# EAGLE design Inverter V2 (EAGLE 9.6.2)
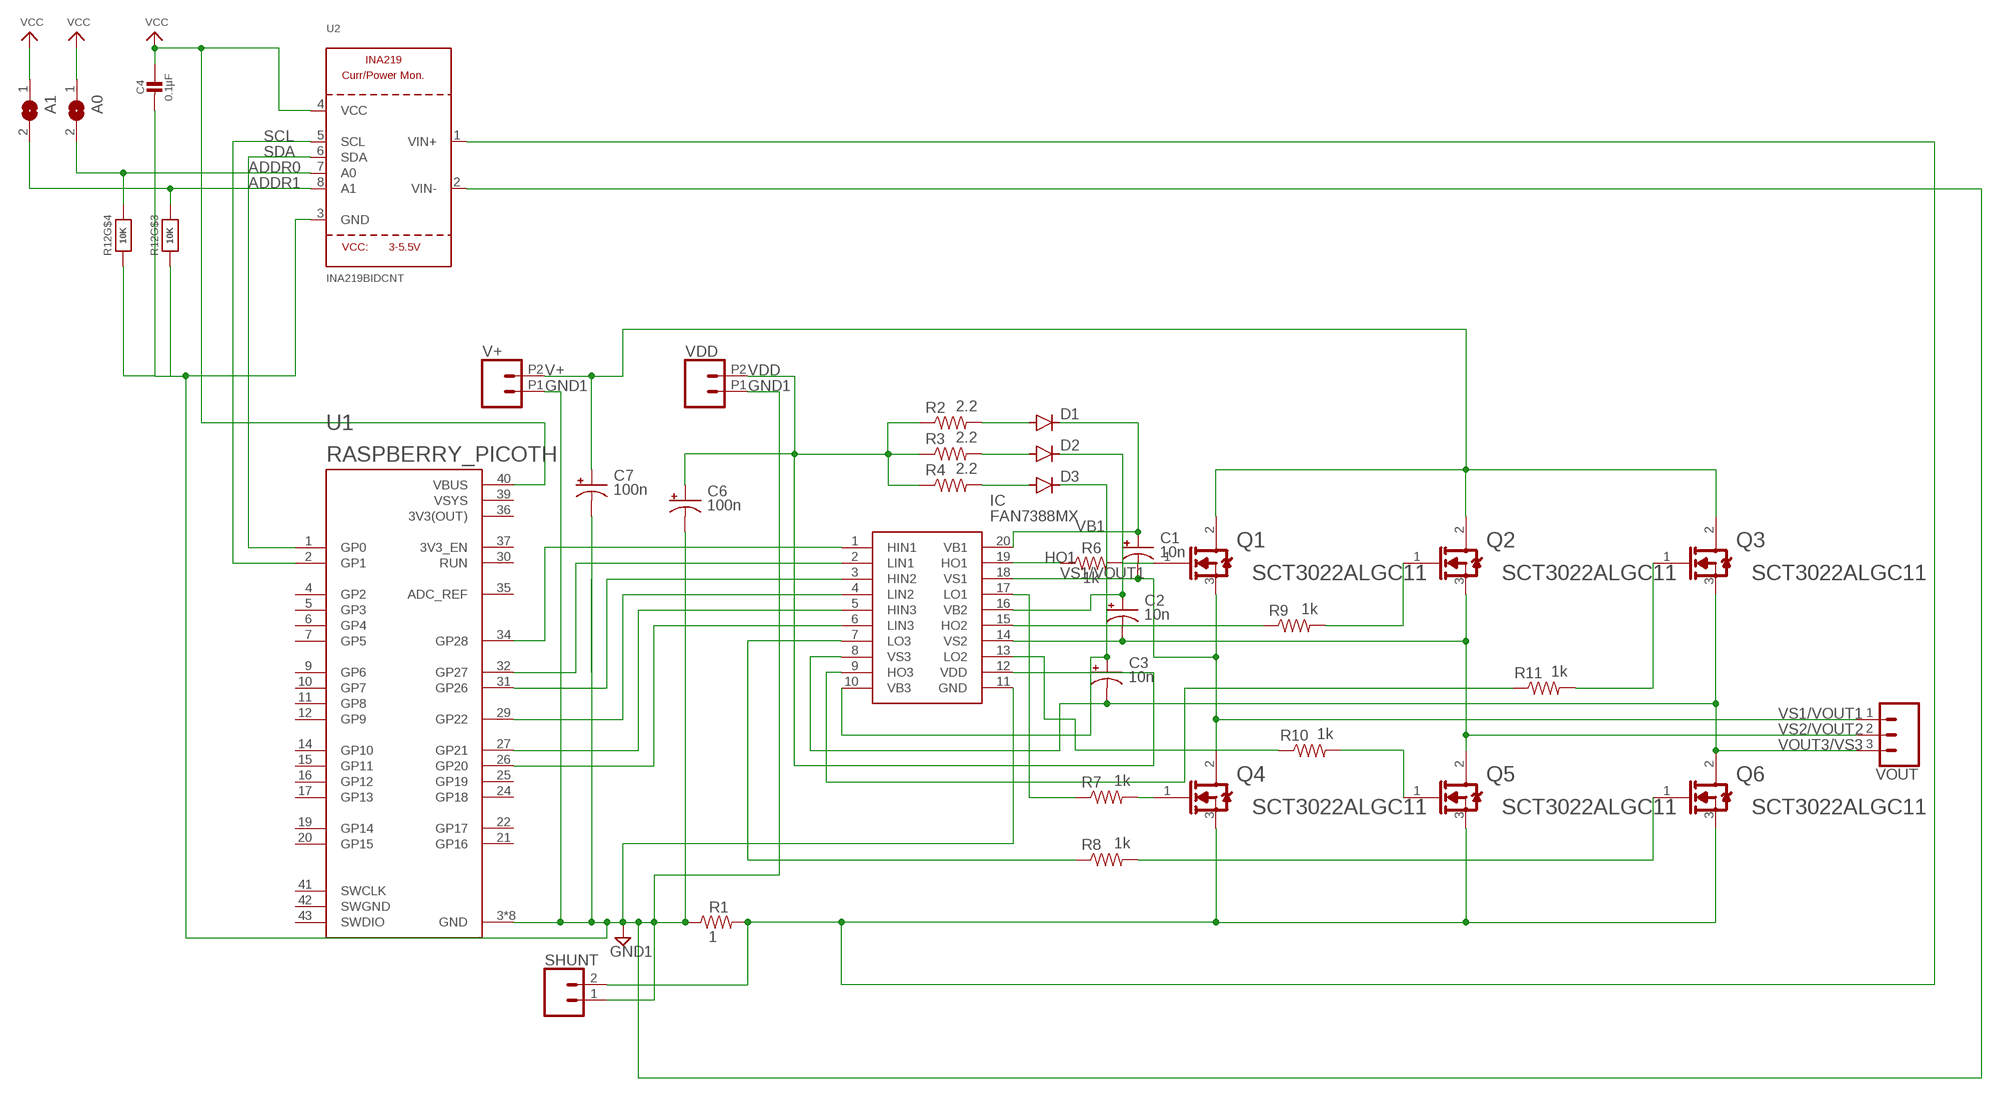
[diagram p0: schematic, sheet 1]

## Parts
A0  SOLDERJUMPERREFLOW_NOPASTE  [SOLDERJUMPER_REFLOW_NOPASTE]
A1  SOLDERJUMPERREFLOW_NOPASTE  [SOLDERJUMPER_REFLOW_NOPASTE]
C1  10n  CPOL-USSMCZ  [SMC_Z]
C2  10n  CPOL-USSMCZ  [SMC_Z]
C3  10n  CPOL-USSMCZ  [SMC_Z]
C4  0.1µF  CAP_CERAMIC0603_NO  [0603-NO]
C6  100n  CPOL-USSMCZ  [SMC_Z]
C7  100n  CPOL-USE5-5  [E5-5]
D1  DIODE-GF1  [GF1]
D2  DIODE-GF1  [GF1]
D3  DIODE-GF1  [GF1]
IC  FAN7388MX  [SOIC127P1032X265-20N]
Q1  ROHM_SCT3022ALGC11ROHM_SCT3022ALGC11_0_0  [ROHM_SCT3022ALGC11_0]
Q2  ROHM_SCT3022ALGC11ROHM_SCT3022ALGC11_0_0  [ROHM_SCT3022ALGC11_0]
Q3  ROHM_SCT3022ALGC11ROHM_SCT3022ALGC11_0_0  [ROHM_SCT3022ALGC11_0]
Q4  ROHM_SCT3022ALGC11ROHM_SCT3022ALGC11_0_0  [ROHM_SCT3022ALGC11_0]
Q5  ROHM_SCT3022ALGC11ROHM_SCT3022ALGC11_0_0  [ROHM_SCT3022ALGC11_0]
Q6  ROHM_SCT3022ALGC11ROHM_SCT3022ALGC11_0_0  [ROHM_SCT3022ALGC11_0]
R1  1  R-US_0207/10  [0207/10]
R2  2.2  RESISTOR0603  [0603]
R3  2.2  RESISTOR0603  [0603]
R4  2.2  RESISTOR0603  [0603]
R6  1k  RESISTOR0603  [0603]
R7  1k  RESISTOR0603  [0603]
R8  1k  RESISTOR0603  [0603]
R9  1k  RESISTOR0603  [0603]
R10  1k  RESISTOR0603  [0603]
R11  1k  RESISTOR0603  [0603]
R12  10K  RESISTOR_4PACK  [RESPACK_4X0603]
SHUNT  CONN_02PTH4  [1X02_XTRA_BIG]
U1  RASPBERRY_PICOTH  [PICO-PKG-TH]
U2  INA219BIDCNT  INA219  [SOT23-8]
V+  CONN_022.54MM_SCREWTERM  [1X02_2.54_SCREWTERM]
VDD  CONN_022.54MM_SCREWTERM  [1X02_2.54_SCREWTERM]
VOUT  CONN_03SCREW-NS  [SCREWTERMINAL-3.5MM-3-NS]

## Nets
ADDR0: A0.2 R12.5 U2.7(A0)
ADDR1: A1.2 R12.6 U2.8(A1)
GND1: C4.2 C6.- C7.- IC.11(GND) R1.1 R12.3 R12.4 SHUNT.1 U1.3(GND) U1.8(GND) U1.13(GND) U1.18(GND) U1.23(GND) U1.28(GND) U1.33(GND) U1.38(GND) U2.2(VIN-) U2.3(GND) V+.P1 VDD.P1
HIN1: IC.1(HIN1) U1.34(GP28)
HIN3: IC.5(HIN3) U1.27(GP21)
HO1: IC.19(HO1) R6.1
HO2: IC.15(HO2) R9.1
HO3: IC.9(HO3) R11.1
LIN1: IC.2(LIN1) U1.32(GP27)
LIN2: IC.4(LIN2) U1.29(GP22)
LIN3: IC.6(LIN3) U1.26(GP20)
LO1: IC.17(LO1) R7.1
LO2: IC.13(LO2) R10.1
LO3: IC.7(LO3) R8.1
N$4: IC.3(HIN2) U1.31(GP26)
N$13: D1.A R2.2
N$15: D2.A R3.2
N$17: D3.A R4.2
SCL: U1.2(GP1) U2.5(SCL)
SDA: U1.1(GP0) U2.6(SDA)
SHUNT: Q4.3(SOURCE) Q5.3(SOURCE) Q6.3(SOURCE) R1.2 SHUNT.2 U2.1(VIN+)
V+: C7.+ Q1.2(DRAIN) Q2.2(DRAIN) Q3.2(DRAIN) V+.P2
VB1: C1.+ D1.C IC.20(VB1)
VB2: C2.+ D2.C IC.16(VB2)
VB3: C3.+ D3.C IC.10(VB3)
VCC: A0.1 A1.1 C4.1 U1.40(VBUS) U2.4(VCC)
VDD: C6.+ IC.12(VDD) R2.1 R3.1 R4.1 VDD.P2
VGIN1: Q1.1(GATE) R6.2
VGIN2: Q2.1(GATE) R9.2
VGIN3: Q3.1(GATE) R11.2
VGIN4: Q4.1(GATE) R7.2
VGIN5: Q5.1(GATE) R10.2
VGIN6: Q6.1(GATE) R8.2
VOUT3/VS3: C3.- IC.8(VS3) Q3.3(SOURCE) Q6.2(DRAIN) VOUT.3
VS1/VOUT1: C1.- IC.18(VS1) Q1.3(SOURCE) Q4.2(DRAIN) VOUT.1
VS2/VOUT2: C2.- IC.14(VS2) Q2.3(SOURCE) Q5.2(DRAIN) VOUT.2
Unconnected: R12.1 R12.2 R12.7 R12.8 U1.4(GP2) U1.5(GP3) U1.6(GP4) U1.7(GP5) U1.9(GP6) U1.10(GP7) U1.11(GP8) U1.12(GP9) U1.14(GP10) U1.15(GP11) U1.16(GP12) U1.17(GP13) U1.19(GP14) U1.20(GP15) U1.21(GP16) U1.22(GP17) U1.24(GP18) U1.25(GP19) U1.30(RUN) U1.35(ADC_REF) U1.37(3V3_EN) U1.41(SWCLK) U1.43(SWDIO)

## Power pins joined to a net without a drawn wire
3V3(OUT): U1.36(3V3(OUT))
SWGND: U1.42(SWGND)
VSYS: U1.39(VSYS)

## Library data of the parts
A0 A1 = microbuilder:SOLDERJUMPER: SMD Solder JUMPER Solder the two pads together to create a connection, or remove the solder to break it. REFLOW - Use this footprint for solder paste and reflow ovens. WAVE - Use this footprint for hand-soldering (larger pads). CLOSED - Has a trace between the two pads to ensure it is closed by default. The trace needs to be cut to disable the jumper, and can be closed again by creating a solder bridge between the two pads.
C1-C3 C6 C7 = rcl:CPOL-US: POLARIZED CAPACITOR, American symbol; SPICEPREFIX: C
C4 = microbuilder:CAP_CERAMIC: Ceramic Capacitors For new designs, use the packages preceded by an '_' character since they are more reliable: The following footprints should be used on most boards: _0402 - Standard footprint for regular board layouts _0603 - Standard footprint for regular board layouts _0805 - Standard footprint for regular board layouts _1206 - Standard footprint for regular board layouts For extremely tight-pitch boards where space is at a premium, the following 'micro-pitch' footprints can be used (smaller pads, no silkscreen outline, etc.): _0402MP - Micro-pitch footprint for very dense/compact boards _0603MP - Micro-pitch footprint for very dense/compact boards _0805MP - Micro-pitch footprint for very dense/compact boards _1206MP - Micro-pitch footprint for very dense/compact boards
D1-D3 = diode:DIODE-: DIODE
IC = FAN7388MX:FAN7388MX: IC, Fairchild, FAN7388MX Fairchild Semiconductor FAN7388MX, Triple MOSFET Power Driver 350 mA, 650 mA Half Bridge, 10 20 V, Inverting Source: Datasheet <https://componentsearchengine.com/Datasheets/1/FAN7388MX.pdf>; DESCRIPTION: IC, Fairchild, FAN7388MX Fairchild Semiconductor FAN7388MX, Triple MOSFET Power Driver 350 mA, 650 mA Half Bridge, 10 20 V, Inverting; HEIGHT: 2.65mm; MANUFACTURER_NAME: onsemi; MANUFACTURER_PART_NUMBER: FAN7388MX; MOUSER_PART_NUMBER: 512-FAN7388MX; MOUSER_PRICE-STOCK: https://www.mouser.com/Search/Refine.aspx?Keyword=512-FAN7388MX
Q1-Q6 = ROHM - SCT3022ALGC11:ROHM_SCT3022ALGC11: MOSFET NCH 650V 93A TO247N; CENTROID_NOT_SPECIFIED: No; CONTINUOUS_DRAIN_CURRENT: 93A; DATASHEET: https://www.rohm.com/datasheet/SCT3022AL/sct3022al-e; DEVICE_CLASS_L1: Discrete Semiconductors; DEVICE_CLASS_L2: Transistors; DEVICE_CLASS_L3: MOSFETs; DIGIKEY_DESCRIPTION: TRANS MOSFET NCH 650V 93A TO247N; DIGIKEY_PART_NUMBER: SCT3022ALGC11-ND; DRAIN_TO_SOURCE_BREAKDOWN_VOLTAGE: 650V; DRAIN_TO_SOURCE_RESISTANCE: 22mΩ; DRAIN_TO_SOURCE_VOLTAGE: 650V; FOOTPRINT_URL: https://d1d2qsbl8m0m72.cloudfront.net/en/techdata_basic/power/dimension/SiC_TO-247N-e.pdf; GATE_TO_SOURCE_VOLTAGE: 22V; HEIGHT: 25.5mm; INPUT_CAPACITACE_AT_VDS: 2208pF @ 500V; LEAD_FREE: yes; MAX_JUNCTION_TEMP: +175°C; MF: ROHM; MFG_PACKAGE_IDENT: SCT3022ALGC11; MFG_PACKAGE_IDENT_DATE: 2/2017; MFG_PACKAGE_IDENT_REV: 001; MOUSER_DESCRIPTION: SCT3022AL Series 650 V 93 A 28.6 mOhm N-Channel SiC Power Mosfet - TO-247N; MOUSER_PART_NUMBER: 755-SCT3022ALGC11; MPN: SCT3022ALGC11; NUMBER_OF_CHANNELS: 1; NUMBER_OF_N_CHANNELS: 1; PACKAGE: TO247; POWER_DISSIPATION: 339W; PREFIX: Q; ROHS: yes; STANDOFF_HEIGHT: 3.8mm; TECHNOLOGY: MOSFET; TEMPERATURE_RANGE_HIGH: +175°C; THRESHOLD_VGS: 2.7V; TURN_OFF_DELAY_TIME: 61ns; TURN_ON_DELAY_TIME: 25ns; VERIFICATION_VERSION: 0.0.0.1
R1 = rcl:R-US_: RESISTOR, American symbol; SPICEPREFIX: R
R2-R4 R6-R11 = SparkFun-Resistors:RESISTOR: Generic Resistor Package
R12 = microbuilder:RESISTOR_4PACK: Resistor Packs (4 resistors) 4 x 0603 10K 1/16W - Digikey: YC164J-10KCT-ND
SHUNT V+ VDD = SparkFun-Connectors:CONN_02: Multi connection point. Often used as Generic Header-pin footprint for 0.1 inch spaced/style header connections On any of the 0.1 inch spaced packages, you can populate with these: Break Away Headers - Straight <https://www.sparkfun.com/products/116> (PRT-00116) Break Away Male Headers - Right Angle <https://www.sparkfun.com/products/553> (PRT-00553) Female Headers <https://www.sparkfun.com/products/115> (PRT-00115) Break Away Headers - Machine Pin <https://www.sparkfun.com/products/117> (PRT-00117) Break Away Female Headers - Swiss Machine Pin <https://www.sparkfun.com/products/743> (PRT-00743) For SCREWTERMINALS and SPRING TERMINALS visit here: Screw Terimnals on SparkFun.com <https://www.sparkfun.com/search/results?term=Screw+Terminals> (5mm/3.5mm/2.54mm spacing) This device is also useful as a general connection point to wire up your design to another part of your project. Our various solder wires solder well into these plated through hole pads. Hook-Up Wire - Assortment (Stranded, 22 AWG) <https://www.sparkfun.com/products/11375> (PRT-11375) Hook-Up Wire - Assortment (Solid Core, 22 AWG) <https://www.sparkfun.com/products/11367> (PRT-11367) View the entire wire category on our website here <https://www.sparkfun.com/categories/141> Special notes: Molex polarized connector foot print use with: PRT-08233 with associated crimp pins and housings. 2.54_SCREWTERM for use with PRT-10571. 3.5mm Screw Terminal footprints for PRT-08084 5mm Screw Terminal footprints for use with PRT-08432
U1 = RpiPico:RASPBERRY_PICO: Raspberry Pi Pico
U2 = microbuilder:INA219: INA219 - I2C Current/Power Monitor Voltage Range: 0-26V Accuracy: 0.5% Temperature: -40°C - 125°C
VOUT = SparkFun-Connectors:CONN_03: Multi connection point. Often used as Generic Header-pin footprint for 0.1 inch spaced/style header connections On any of the 0.1 inch spaced packages, you can populate with these: Break Away Headers - Straight <https://www.sparkfun.com/products/116> (PRT-00116) Break Away Male Headers - Right Angle <https://www.sparkfun.com/products/553> (PRT-00553) Female Headers <https://www.sparkfun.com/products/115> (PRT-00115) Break Away Headers - Machine Pin <https://www.sparkfun.com/products/117> (PRT-00117) Break Away Female Headers - Swiss Machine Pin <https://www.sparkfun.com/products/743> (PRT-00743) Stackable Header - 3 Pin (Female, 0.1") <https://www.sparkfun.com/products/13875> (PRT-13875) For SCREWTERMINALS and SPRING TERMINALS visit here: Screw Terimnals on SparkFun.com <https://www.sparkfun.com/search/results?term=Screw+Terminals> (5mm/3.5mm/2.54mm spacing) This device is also useful as a general connection point to wire up your design to another part of your project. Our various solder wires solder well into these plated through hole pads. Hook-Up Wire - Assortment (Stranded, 22 AWG) <https://www.sparkfun.com/products/11375> (PRT-11375) Hook-Up Wire - Assortment (Solid Core, 22 AWG) <https://www.sparkfun.com/products/11367> (PRT-11367) View the entire wire category on our website here <https://www.sparkfun.com/categories/141> Special notes: Molex polarized connector foot print use with SKU : PRT-08232 with associated crimp pins and housings.

## Board
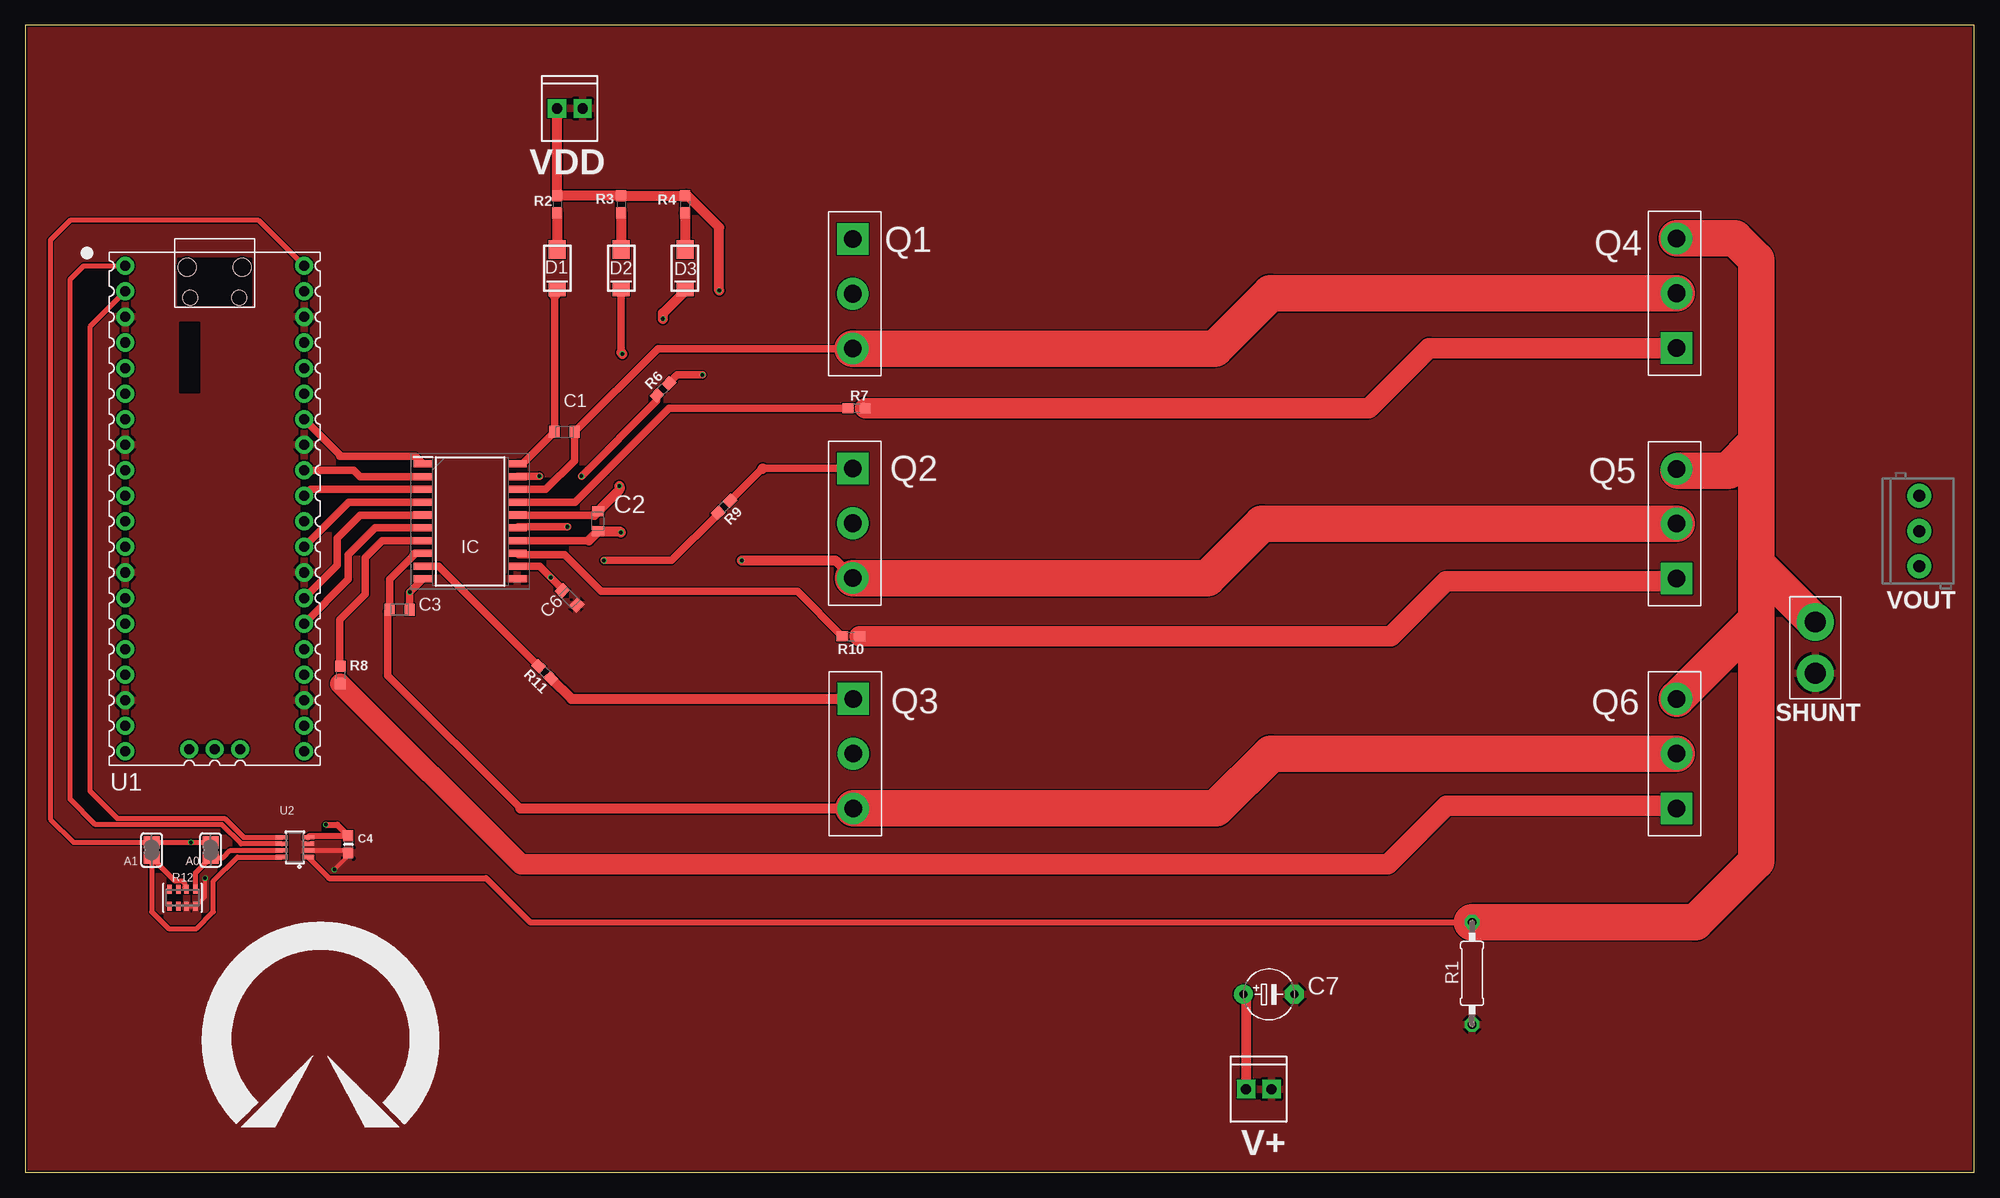
[diagram p1: board, top side]
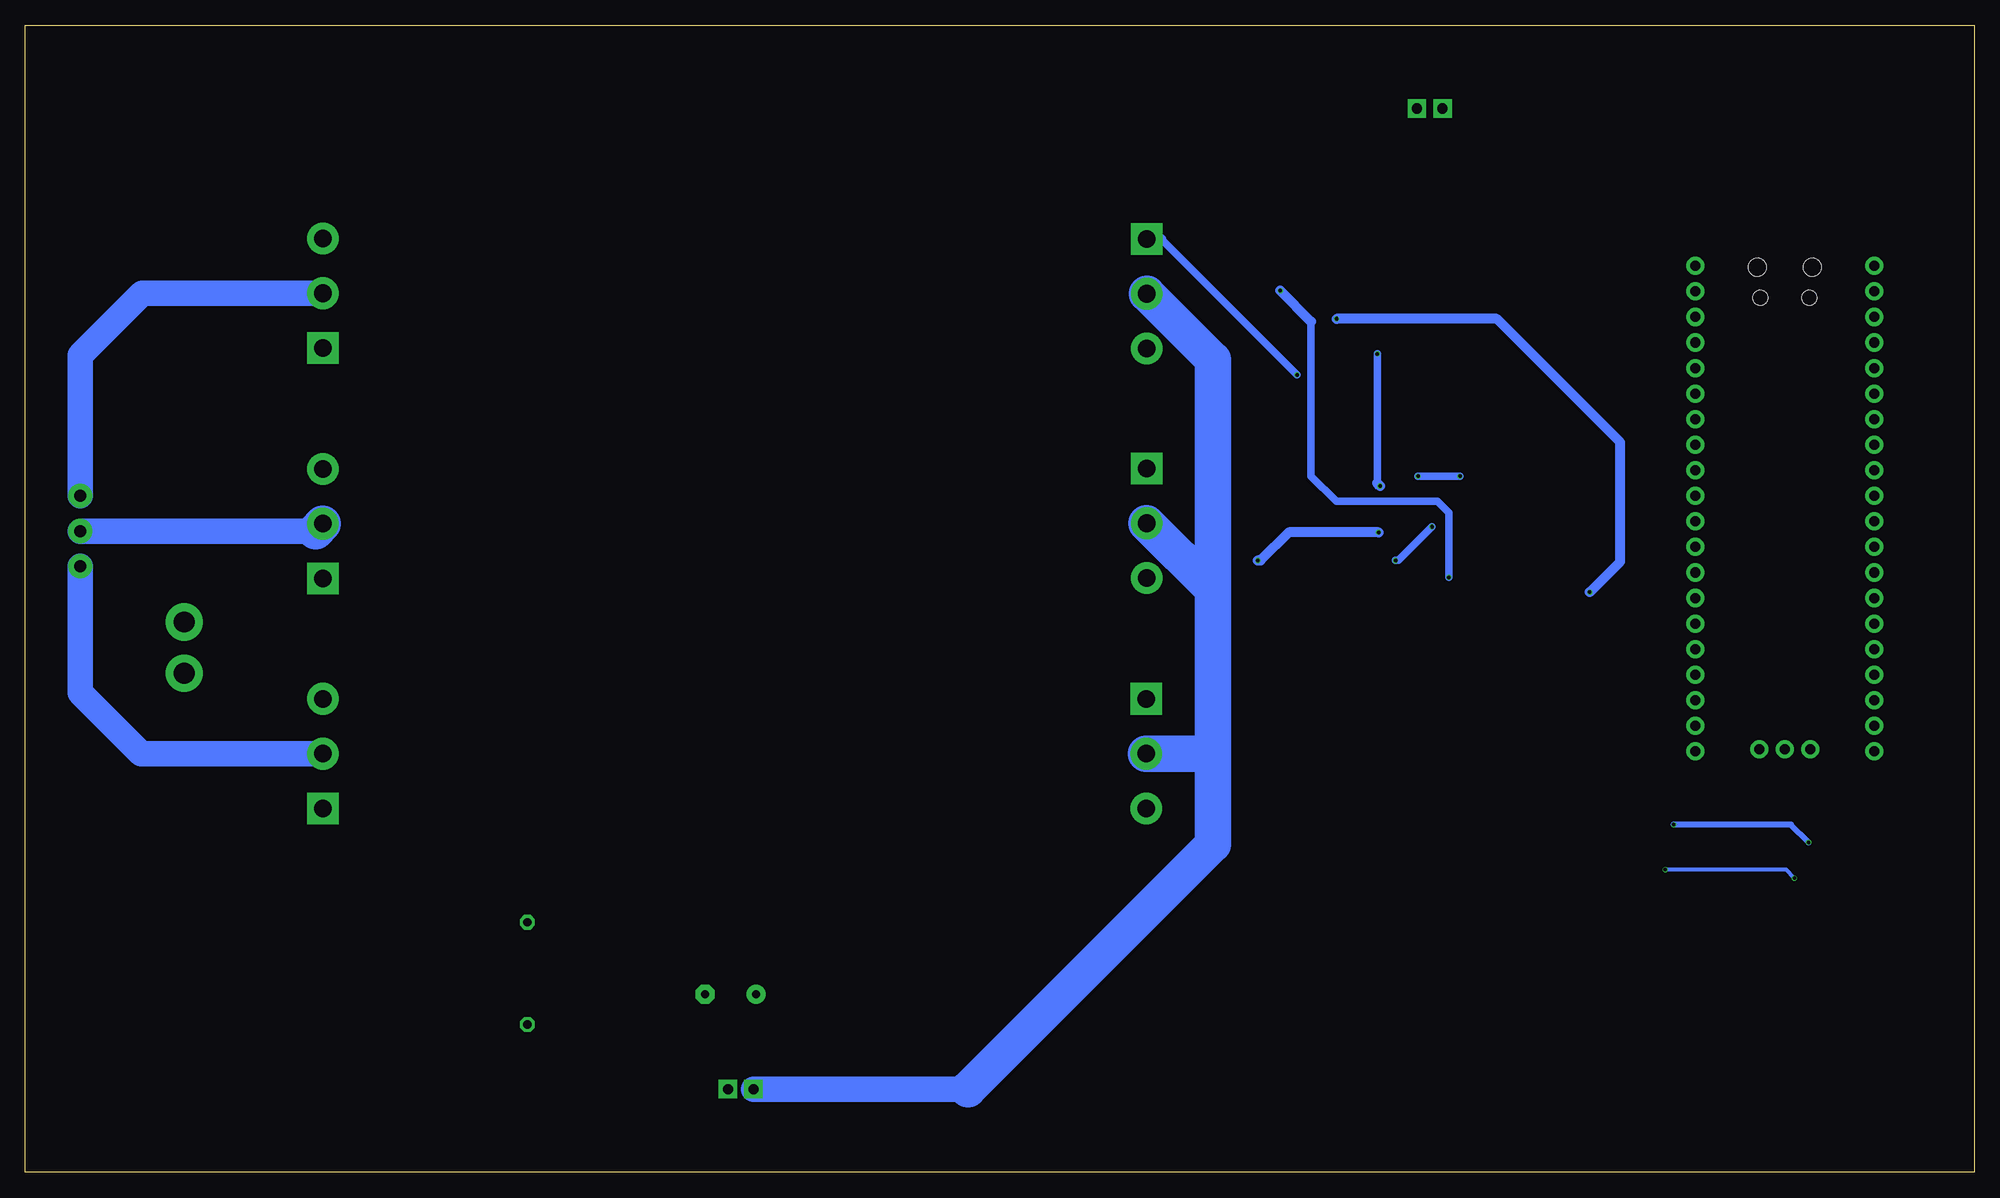
[diagram p2: board, bottom side, seen from below]

Size 193.8 x 114.05 mm. Coordinates in mm from the lower left corner, seen from the top.
Outline: 0,0 193.8,0 193.8,114.05 0,114.05 0,0
Copper layers (1*16): Top 0.035mm / dielectric 1.6mm / Bottom 0.035mm
Design rules "jlcpcb-2layers": minimum track width 5mil, minimum drill 0.3mm, track to track 5mil, track to pad 5mil, pad to pad 5mil, via to via 5mil, smd to smd 5mil, copper to edge 0.2mm, drill to drill 6mil, minimum pad ring 10mil, minimum via ring 3mil, stop-mask expansion 4mil, vias tented up to drill 0mil, thermal gap 10mil

### Footprints (pad centres in the part's own frame; a part is rotated, then mirrored left to right if it is on the bottom)
SOLDERJUMPER_REFLOW_NOPASTE = smd 1.168 x 1.6: 1 -0.762,0; 2 0.762,0
SMC_Z = smd 1 x 1.2: + -1,0; - 1,0
0603-NO = smd 1.075 x 1: 1 -0.85,0; 2 0.85,0
E5-5 = drill 0.813 pad 1.905: + -2.54,0 | drill 0.813 pad 1.905 octagon: - 2.54,0
GF1 = smd 1.85 x 1.68: A 1.87,0 | smd 1.32 x 1.68: C -2.12,0
SOIC127P1032X265-20N = smd 1.875 x 0.7: 1 -4.688,5.715; 2 -4.688,4.445; 3 -4.688,3.175; 4 -4.688,1.905; 5 -4.688,0.635; 6 -4.688,-0.635; 7 -4.688,-1.905; 8 -4.688,-3.175; 9 -4.688,-4.445; 10 -4.688,-5.715; 11 4.688,-5.715; 12 4.688,-4.445; 13 4.688,-3.175; 14 4.688,-1.905; 15 4.688,-0.635; 16 4.688,0.635; 17 4.688,1.905; 18 4.688,3.175; 19 4.688,4.445; 20 4.688,5.715
ROHM_SCT3022ALGC11_0 = drill 1.75 pad 2.65 square: 1 -0.2,5.45 | drill 1.75 pad 2.65: 2 -0.2,0; 3 -0.2,-5.45
0207/10 = drill 0.813 octagon: 1 -5.08,0; 2 5.08,0
0603 = smd 1.1 x 1: 1 -0.85,0; 2 0.85,0
RESPACK_4X0603 = smd 0.45 x 0.9: 1 -1.3,-0.85; 2 -0.4,-0.85; 3 0.4,-0.85; 4 1.3,-0.85; 5 1.3,0.85; 6 0.4,0.85; 7 -0.4,0.85; 8 -1.3,0.85
1X02_XTRA_BIG = drill 2.057 pad 3.556: 1 -2.54,0; 2 2.54,0
PICO-PKG-TH = drill 1: 1 -8.89,24.13; 2 -8.89,21.59; 3 -8.89,19.05; 4 -8.89,16.51; 5 -8.89,13.97; 6 -8.89,11.43; 7 -8.89,8.89; 8 -8.89,6.35; 9 -8.89,3.81; 10 -8.89,1.27; 11 -8.89,-1.27; 12 -8.89,-3.81; 13 -8.89,-6.35; 14 -8.89,-8.89; 15 -8.89,-11.43; 16 -8.89,-13.97; 17 -8.89,-16.51; 18 -8.89,-19.05; 19 -8.89,-21.59; 20 -8.89,-24.13; 21 8.89,-24.13; 22 8.89,-21.59; 23 8.89,-19.05; 24 8.89,-16.51; 25 8.89,-13.97; 26 8.89,-11.43; 27 8.89,-8.89; 28 8.89,-6.35; 29 8.89,-3.81; 30 8.89,-1.27; 31 8.89,1.27; 32 8.89,3.81; 33 8.89,6.35; 34 8.89,8.89; 35 8.89,11.43; 36 8.89,13.97; 37 8.89,16.51; 38 8.89,19.05; 39 8.89,21.59; 40 8.89,24.13; 41 -2.54,-23.9; 42 0,-23.9; 43 2.54,-23.9 | hole 1.8: -2.725,24; 2.725,24 | hole 1.5: -2.425,20.97; 2.425,20.97
SOT23-8 = smd 0.4 x 1.2: 1 -0.975,-1.3; 2 -0.325,-1.3; 3 0.325,-1.3; 4 0.975,-1.3; 5 0.975,1.3; 6 0.325,1.3; 7 -0.325,1.3; 8 -0.975,1.3
1X02_2.54_SCREWTERM = drill 1.016 square: P1 2.54,0; P2 0,0
SCREWTERMINAL-3.5MM-3-NS = drill 1.2 pad 2.413: 1 0,0; 2 3.5,0; 3 7,0

### Placement (x,y rotation side)
A0  18.44,32.05 270 top
A1  12.57,32.05 270 top
C1  53.62,73.61 0 top
C2  56.95,64.72 270 top
C3  37.24,55.96 180 top
C4  32.13,32.61 270 top
C6  54.13,57.12 315 top
C7  123.67,17.7 0 top
D1  52.91,89.89 90 top
D2  59.26,89.89 90 top
D3  65.61,89.89 90 top
IC  44.25,64.72 0 top
Q1  82.47,87.35 0 top
Q2  82.5,64.54 0 top
Q3  82.55,41.63 0 top
Q4  164.01,87.4 180 top
Q5  164.01,64.49 180 top
Q6  164.01,41.63 180 top
R1  143.87,19.79 90 top
R2  52.91,96.24 270 top
R3  59.26,96.24 270 top
R4  65.61,96.24 270 top
R6  63.41,77.86 45 top
R7  82.65,75.97 0 top
R8  31.34,49.45 270 top
R9  69.49,66.17 45 top
R10  82.09,53.29 0 top
R11  51.66,49.73 315 top
R12  15.65,27.3 0 top
SHUNT  177.98,52.17 90 top
U1  18.85,65.99 0 top
U2  26.82,32.33 90 top
V+  121.39,8.28 0 top
VDD  52.88,105.77 0 top
VOUT  188.32,67.26 270 top

### Tracks (layer width: path | path; a pad name or v marks a point on that pad's centre or on a via)
ADDR0
  Top 0.508: R12.5 16.95,29.8 A0.2 19.68,31.29 20.39,32.01 U2.7
ADDR1
  Top 0.508: R12.6 15.85,28.35 15.85,28.76 15.63,28.99 14.88,28.99 A1.2 12.57,25.91 14.25,24.23 17.04,24.23 18.72,25.91 18.72,28.98 21.1,31.36 U2.8
GND1  (via drill 0.35)
  Top 0.381: R12.3 R12.4 17.88,27.39 v17.88,29.26 | v30.73,30.1 32.13,31.5 C4.2
  Top 0.508: U2.2 31.89,32.01 C4.2
  Bottom 0.381: v17.88,29.26 18.72,30.1 v30.73,30.1
  pour Top: 0,114 0,0.28 193.9,0.28 193.9,113.72 0.28,113.72
HIN1
  Top 0.762: U1.34 31.29,71.32 31.29,71.17 38.82,71.17 IC.1
HIN3
  Top 0.762: U1.27 31.01,60.38 31.01,63.07 33.3,65.35 IC.5
HO1  (via drill 0.35)
  Top 0.762: IC.19 48.99,69.22 v51.13,69.22 | v55.32,69.22 62.8,76.7 R6.1
  Bottom 0.762: v51.13,69.22 v55.32,69.22
HO2  (via drill 0.35)
  Top 0.762: IC.15 49.04,64.19 v53.92,64.19 | v57.56,60.83 64.26,60.83 68.87,65.44 R9.1
  Bottom 0.762: v53.92,64.19 57.28,60.83 v57.56,60.83
HO3
  Top 0.762: R11.1 41.12,60.27 IC.9
LIN1
  Top 0.762: U1.32 32.66,69.8 33.3,69.16 IC.2
LIN2
  Top 0.762: U1.29 32.18,66.62 IC.4
LIN3
  Top 0.762: U1.26 32.13,58.95 32.13,61.39 34.82,64.08 IC.6
LO1
  Top 0.762: IC.17 54.69,66.62 64.03,75.97 R7.1
LO2
  Top 0.762: IC.13 49.09,61.39 53.65,61.39 57.28,57.76 76.77,57.76 R10.1
LO3
  Top 0.762: IC.7 39.53,62.79 35.48,62.79 33.81,61.11 33.81,57.48 31.29,54.97 31.29,50.35 R8.1
N$4
  Top 0.762: U1.31 28.37,67.89 IC.3
N$13
  Top 1.016: R2.2 D1.A
N$15
  Top 1.016: R3.2 D2.A
N$17
  Top 1.016: R4.2 D3.A
SCL
  Top 0.508: U1.2 6.43,84.05 6.43,37.92 9.14,35.2 19.82,35.2 21.72,33.31 U2.5
SDA
  Top 0.508: U2.6 21.47,32.66 19.56,34.57 6.99,34.57 4.47,37.08 4.47,88.77 5.82,90.12 U1.1
SHUNT
  Top 0.508: U2.1 30.22,29.26
  Top 0.61: 30.22,29.26 45.82,29.26 50.22,24.87 R1.2
  Top 1.016: Q5.3 164.38,69.77
  Top 3.607: Q4.3 169.99,92.85 172.11,90.73 172.11,72.57 | 172.11,72.57 169.32,69.77 164.38,69.77 | 172.11,72.57 172.11,60.58 | 172.11,60.58 SHUNT.2 | 172.11,54.98 172.11,30.94 166.04,24.87 R1.2 | Q6.3 172.11,54.98 | 172.11,54.98 172.11,60.58
V+
  Top 1.016: C7.+ 121.39,17.45 V+.P2
  Bottom 1.016: 75.72,39.6 77.75,41.63
  Bottom 2.54: V+.P2 100.05,8.28
  Bottom 3.607: 100.05,8.28 75.72,32.61 75.72,39.6 75.72,57.96 | 77.75,41.63 Q3.2 | Q2.2 75.72,57.96 | Q1.2 75.72,80.79 75.72,57.96
VB1
  Top 0.762: 52.62,87.19 C1.+ 49.44,70.43 IC.20
  Top 1.016: D1.C 52.91,87.48 52.62,87.19
VB2  (via drill 0.35)
  Top 0.762: IC.16 56.58,65.35 | D2.C 59.26,81.48
  Top 1.016: 56.58,65.35 C2.+ 59.09,67.86 v59.09,68.24 | 59.26,81.48 v59.37,81.37
  Bottom 0.762: v59.37,81.37 59.37,68.52
  Bottom 1.016: v59.09,68.24 59.37,68.52
VB3  (via drill 0.35)
  Top 0.762: IC.10 v38.24,57.68 C3.+
  Top 1.016: v63.42,84.86 63.42,85.42 65.61,87.61 D3.C
  Bottom 1.016: v38.24,57.68 35.2,60.71 35.2,72.57 47.5,84.86 v63.42,84.86
VCC  (via drill 0.35)
  Top 0.508: A0.1 v16.48,32.82 A1.1 4.83,32.82 2.52,35.13 2.52,92.69 4.47,94.64 23.22,94.64 U1.40
  Top 0.61: U2.4 28.28,33.46 C4.1 31.02,34.57 v29.9,34.57
  Bottom 0.61: v16.48,32.82 18.24,34.57 v29.9,34.57
VDD  (via drill 0.35)
  Top 0.762: IC.12 51.14,60.27 v52.25,59.16 53.32,58.09 C6.+
  Top 1.016: VDD.P2 52.91,104.88 R2.1 R3.1 R4.1 65.65,97.13 65.81,97.13 69.01,93.94 v69.01,87.66
  Bottom 0.762: v52.25,59.16 52.25,65.59 53.37,66.7 63.42,66.7 65.94,69.22 65.94,84.58
  Bottom 1.016: 65.94,84.58 v69.01,87.66
VGIN1  (via drill 0.35)
  Top 0.762: R6.2 64.82,79.27 v67.33,79.27
  Bottom 0.762: 80.86,92.8 v67.33,79.27
  Bottom 1.016: Q1.1 80.86,92.8
VGIN2
  Top 0.762: R9.2 73.27,69.94 | 73.33,69.99 Q2.1
  Top 1.016: 73.33,69.99 73.27,69.94
VGIN3
  Top 1.016: R11.2 54.32,47.08 Q3.1
VGIN4
  Top 2.032: R7.2 133.6,75.97 139.58,81.95 Q4.1
VGIN5
  Top 2.032: R10.2 135.79,53.29 141.26,58.76 163.93,58.76 Q5.1
VGIN6
  Top 2.032: Q6.1 163.93,36.46 141.31,36.46 135.51,30.66 49.29,30.66 R8.2
VOUT3/VS3
  Top 0.762: IC.8 38.72,61.54 38.59,61.41 38.69,61.41 36.24,58.96 C3.- 36.04,55.76 36.04,49.38 49.24,36.18
  Top 1.016: 49.24,36.18 Q3.3
  Top 3.607: Q3.3 118.4,36.18 123.85,41.63 Q6.2
  Bottom 2.54: Q6.2 182.25,41.63 188.32,47.7 VOUT.3
VS1/VOUT1
  Top 0.762: IC.18 51.77,67.89 54.62,70.75 C1.- 62.91,81.9 Q1.3
  Top 3.607: Q1.3 118.3,81.9 123.8,87.4 Q4.2
  Bottom 2.54: Q4.2 182.14,87.4 188.32,81.23 VOUT.1
VS2/VOUT2  (via drill 0.35)
  Top 0.762: IC.14 56.04,62.81
  Top 1.016: 56.04,62.81 C2.- 59.14,63.72 v59.23,63.63 | v71.25,60.83 80.55,60.83 Q2.3
  Top 3.607: Q2.3 117.56,59.09 122.96,64.49 Q5.2
  Bottom 1.016: v59.23,63.63 68.17,63.63 70.97,60.83 v71.25,60.83
  Bottom 2.54: VOUT.2 164.94,63.76
  Bottom 3.607: 164.94,63.76 Q5.2

### Text on the board
tPlace: C:/Users/leapa/Desktop/hx logo.bmp | C:/Users/leapa/Desktop/hx logo.bmp